# Altium project NexisIV_power supply.PrjPcb
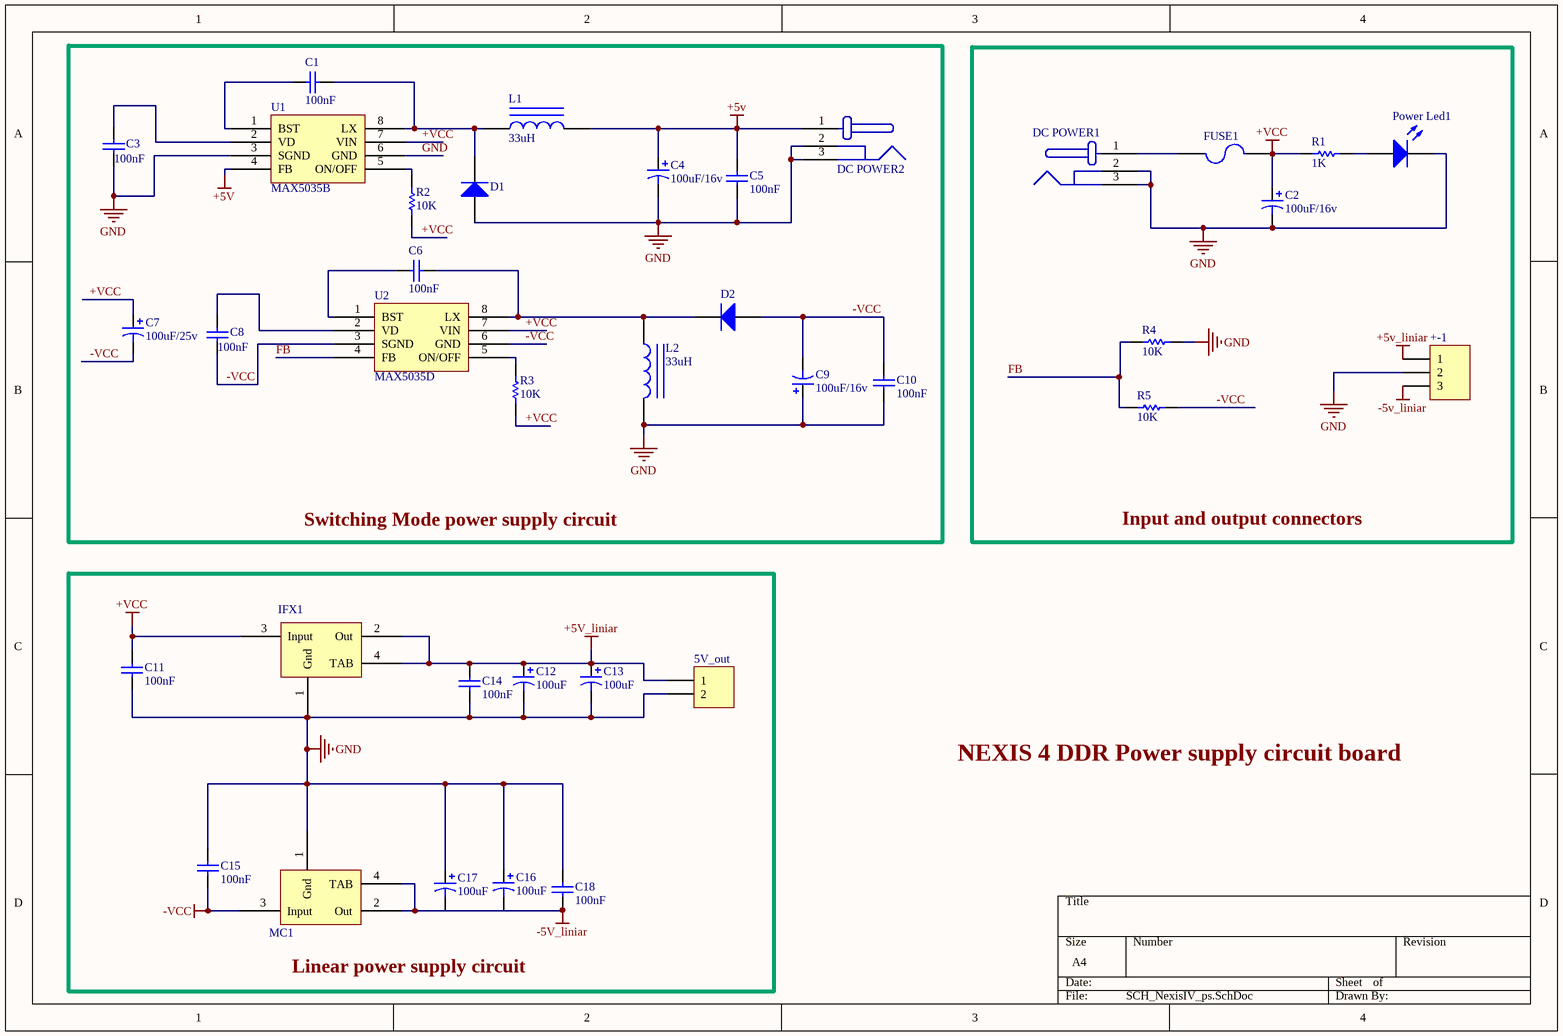
[diagram p0: SCH_NexisIV_ps.SchDoc]
1 sheet, 37 parts. Net scope: global (net labels, ports and power ports of the same name join across sheets).
Board file: PCB_NexisIV_ps.PcbDoc

## Sheet SCH_NexisIV_ps.SchDoc
size A4

### Parts
5V_out  Header 2H  [HDR1X2H]  (value not drawn)
+-1  Header 3  [3pin_header_90]  (value not drawn)
C1  value 100nF  [condensator SMD(1206-v.1 )]  (hidden comment: Cap)
C2  value 100uF/16v  [condensator smd (6,3 x 5)(blank)]  (hidden comment: Cap Pol1)
C3  value 100nF  [Condensator SMD(1608)]  (hidden comment: Cap)
C4  value 100uF/16v  [condensator smd (6,3 x 5)(blank)]  (hidden comment: Cap Pol1)
C5  value 100nF  [Condensator SMD(1608)]  (hidden comment: Cap)
C6  value 100nF  [condensator SMD(1206-v.1 )]  (hidden comment: Cap)
C7  value 100uF/25v  [condensator smd (6,3 x 5)(blank)]  (hidden comment: Cap Pol1)
C8  value 100nF  [Condensator SMD(1608)]  (hidden comment: Cap)
C9  value 100uF/16v  [condensator smd (6,3 x 5)(blank)]  (hidden comment: Cap Pol1)
C10  value 100nF  [Condensator SMD(1608)]  (hidden comment: Cap)
C11  value 100nF  [Condensator SMD(1608)]  (hidden comment: Cap)
C12  value 100uF  [condensator smd (6,3 x 5)(blank)]  (hidden comment: Cap Pol1)
C13  value 100uF  [condensator smd (6,3 x 5)(blank)]  (hidden comment: Cap Pol1)
C14  value 100nF  [Condensator SMD(1608)]  (hidden comment: Cap)
C15  value 100nF  [Condensator SMD(1608)]  (hidden comment: Cap)
C16  value 100uF  [condensator smd (6,3 x 5)(blank)]  (hidden comment: Cap Pol1)
C17  value 100uF  [condensator smd (6,3 x 5)(blank)]  (hidden comment: Cap Pol1)
C18  value 100nF  [Condensator SMD(1608)]  (hidden comment: Cap)
D1  Diode 1N4001  [diodaSMD]  (value not drawn)
D2  Diode 1N4001  [diodaSMD]  (value not drawn)
DC_POWER1  DC POWER  [DC POWER [5.5mm]]  (value not drawn)
DC_POWER2  DC POWER  [DC POWER [5.5mm]]  (value not drawn)
FUSE1  Fuse 2  [Fuse_3216]  (value not drawn)
IFX1  Component_1  [TO-252[me]]  (value not drawn)
L1  value 33uH  [BOBINA_SHOCK_2]  (hidden comment: Inductor Iron)
L2  value 33uH  [BOBINA_SHOCK_2]  (hidden comment: Inductor Iron)
MC1  Component_1  [TO-263-3s]  (value not drawn)
Power_Led1  LED2  [led smd verde]  (value not drawn)
R1  value 1K  [1608(R)]  (hidden comment: Res1)
R2  value 10K  [1608(R)]  (hidden comment: Res1)
R3  value 10K  [1608(R)]  (hidden comment: Res1)
R4  value 10K  [1608(R)]  (hidden comment: Res1)
R5  value 10K  [1608(R)]  (hidden comment: Res1)
U1  MAX5035B  [SOIC 8 pini]
U2  MAX5035D  [SOIC 8 pini]

### Blocks framed on the sheet
Switching Mode power supply circuit: C1 C3-C10 D1 D2 DC_POWER2 L1 L2 R2 R3 U1 U2
Input and output connectors: +-1 C2 DC_POWER1 FUSE1 Power_Led1 R1 R4 R5
Linear power supply circuit: 5V_out C11-C18 IFX1 MC1

### Nets
+5v: C4.1 C5.2 DC_POWER2.1 L1.2 U1.4(FB)
+5v_liniar: 5V_out.1 +-1.1 C12.1 C13.1 C14.2 IFX1.2(Out) IFX1.4(TAB)
+VCC: C2.1 C7.1 C11.2 FUSE1.1 IFX1.3(Input) R1.1 R2.1 R3.1 U1.7(VIN) U2.7(VIN)
-5v_liniar: +-1.3 C18.1 MC1.2(Out) MC1.4(TAB)
-VCC: C7.2 C8.1 C9.2 C10.1 C15.1 D2.1(A) MC1.3(Input) R5.1 U2.3(SGND) U2.6(GND)
GND: 5V_out.2 +-1.2 C2.2 C3.1 C4.2 C5.1 C9.1 C10.2 C11.1 C12.2 C13.2 C14.1 C15.2 C16.1 C17.1 C18.2 D1.1(A) DC_POWER1.2 DC_POWER1.3 DC_POWER2.2 DC_POWER2.3 IFX1.1(Gnd) L2.2 MC1.1(Gnd) Power_Led1.2(K) R4.2 U1.3(SGND) U1.6(GND)
FB: R4.1 R5.2 U2.4(FB)
NetC1_1: C1.1 D1.2(K) L1.1 U1.8(LX)
NetC1_2: C1.2 U1.1(BST)
NetC3_2: C3.2 U1.2(VD)
NetC6_1: C6.1 D2.2(K) L2.1 U2.8(LX)
NetC6_2: C6.2 U2.1(BST)
NetC8_2: C8.2 U2.2(VD)
NetDC_POWER1_1: DC_POWER1.1 FUSE1.2
NetPower_Led1_1: Power_Led1.1(A) R1.2
NetR2_2: R2.2 U1.5(ON/OFF)
NetR3_2: R3.2 U2.5(ON/OFF)

Not connected (* = marked no-connect by the designer): C16 2; C17 2

### Notes on the sheet
- NEXIS 4 DDR Power supply circuit board

### Library data of the parts
5V_out = Header 2H: Header, 2-Pin, Right Angle; LatestRevisionDate: 17-Jul-2002; LatestRevisionNote: Re-released for DXP Platform.; Publisher: Altium Limited
+-1 = Header 3: Header, 3-Pin; LatestRevisionDate: 17-Jul-2002; LatestRevisionNote: Re-released for DXP Platform.; Publisher: Altium Limited
C1 C3 C5 C6 C8 C10 C11 C14 C15 C18 = Cap: Capacitor; Published: 8-Jun-2000; LatestRevisionDate: 17-Jul-2002; LatestRevisionNote: Re-released for DXP Platform.; PackageReference: RAD-0.3; Publisher: Altium Limited; PackageDescription: Radial Cap, Thru-Hole; 2 Leads; 0.3 in Pin Spacing
C2 C4 C7 C9 C12 C13 C16 C17 = Cap Pol1: Polarized Capacitor (Radial); Published: 8-Jun-2000; LatestRevisionDate: 17-Jul-2002; LatestRevisionNote: Re-released for DXP Platform.; PackageReference: RB7.6-15; Publisher: Altium Limited; PackageDescription: Polarized Capacitor (Radial); 2 Leads
D1 D2 = Diode 1N4001: 1 Amp General Purpose Rectifier; Published: 8-Jun-2000; LatestRevisionDate: 17-Jul-2002; LatestRevisionNote: Re-released for DXP Platform.; DatasheetVersion: 1998; PackageVersion: Aug-1999; PackageReference: DO-41; Publisher: Altium Limited; PackageDescription: Diode, Axial; Body 5.2 x 2.7 mm (LxDia. max), Lead Dia. 0.86 mm (max); Code_JEDEC: DO-204-AL; ComponentLink1Description: Manufacturer Link; ComponentLink1URL: http://www.fairchildsemi.com/; ComponentLink2Description: Datasheet; ComponentLink2URL: http://www.fairchildsemi.com/ds/1N%2F1N4001.pdf
FUSE1 = Fuse 2: Fuse; Published: 8-Jun-2000; LatestRevisionDate: 17-Jul-2002; LatestRevisionNote: Re-released for DXP Platform.; PackageReference: PIN-W2/E2.8; Publisher: Altium Limited; PackageDescription: Thru-Hole; 2 Leads
L1 L2 = Inductor Iron: Magnetic-Core Inductor; Published: 24-Mar-1999; LatestRevisionDate: 17-Jul-2002; LatestRevisionNote: Re-released for DXP Platform.; PackageReference: AXIAL-0.9; Publisher: Altium Limited; PackageDescription: Axial Device, Thru-Hole; 2 Leads; 0.9 in Pin Spacing
Power_Led1 = LED2: Typical RED, GREEN, YELLOW, AMBER GaAs LED; Published: 8-Jun-2000; LatestRevisionDate: 17-Jul-2002; LatestRevisionNote: Re-released for DXP Platform.; PackageVersion: Feb-2002; PackageReference: 3.2X1.6X1.1; Publisher: Altium Limited; PackageDescription: SM LED; 2 Flat Leads
R1-R5 = Res1: Resistor; Published: 8-Jun-2000; LatestRevisionDate: 17-Jul-2002; LatestRevisionNote: Re-released for DXP Platform.; PackageReference: AXIAL-0.3; Publisher: Altium Limited; PackageDescription: Axial Device, Thru-Hole; 2 Leads; 0.3 in Pin Spacing
U1 U2 = MAX5035